# Altium schematic sheet SCH_Stepper-Spindle-Controller_2024-04-30.schdoc
size 287 x 171 mm
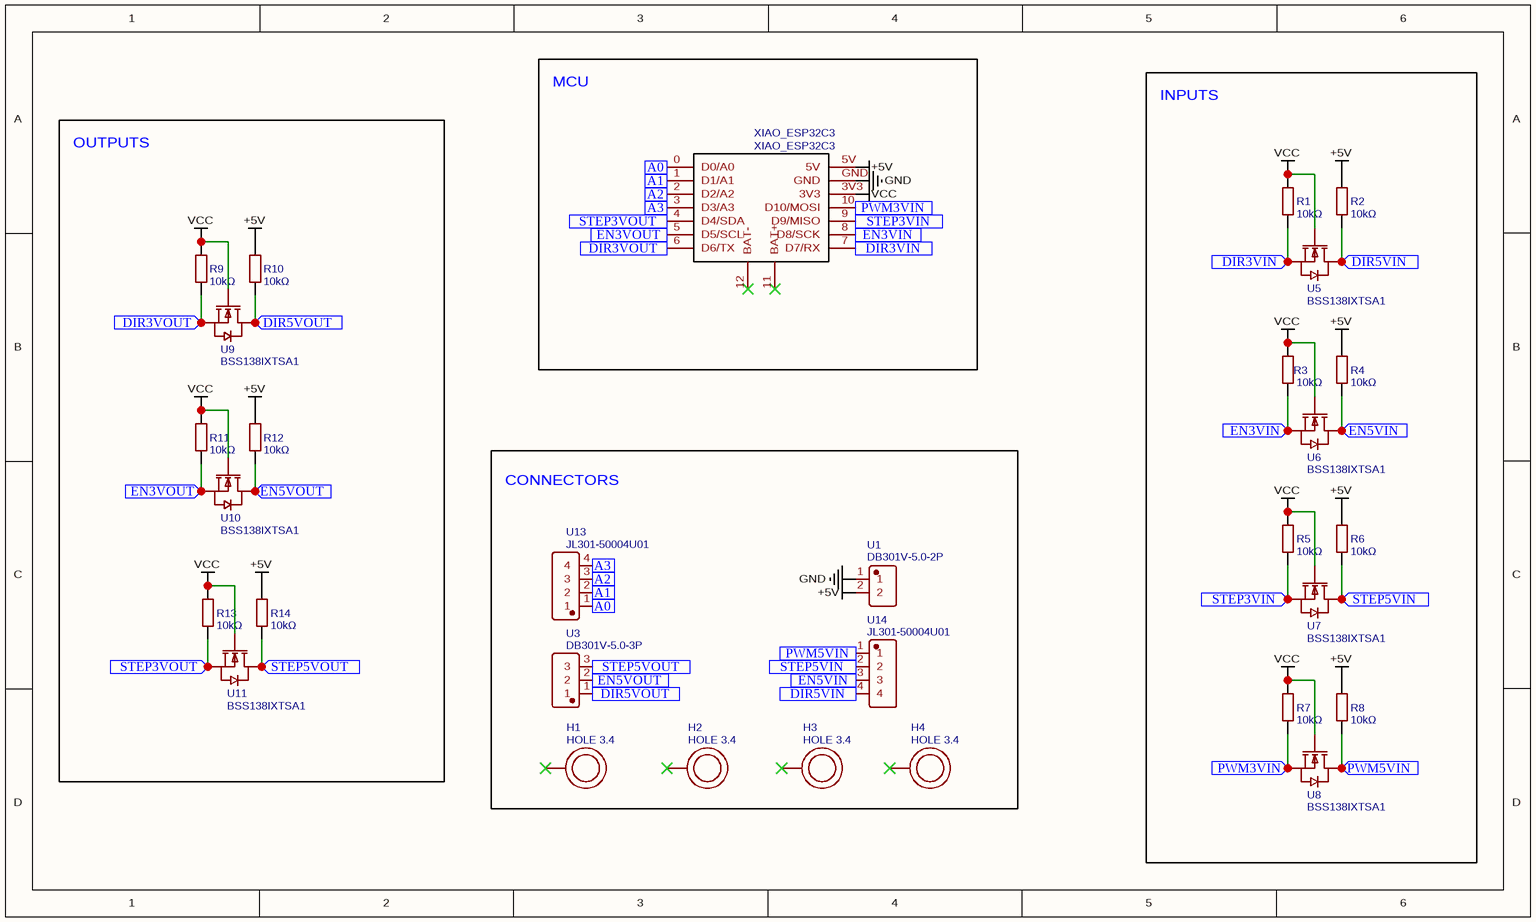
[diagram p0: SCH_Stepper-Spindle-Controller_2024-04-30.schdoc]

## Parts
H1  HOLE 3.4  [HOLEHOLE]
H2  HOLE 3.4  [HOLEHOLE]
H3  HOLE 3.4  [HOLEHOLE]
H4  HOLE 3.4  [HOLEHOLE]
R1  10kΩ  [R0402]
R2  10kΩ  [R0402]
R3  10kΩ  [R0402]
R4  10kΩ  [R0402]
R5  10kΩ  [R0402]
R6  10kΩ  [R0402]
R7  10kΩ  [R0402]
R8  10kΩ  [R0402]
R9  10kΩ  [R0402]
R10  10kΩ  [R0402]
R11  10kΩ  [R0402]
R12  10kΩ  [R0402]
R13  10kΩ  [R0402]
R14  10kΩ  [R0402]
U1  DB301V-5.0-2P  [CONN-TH_2P-P5.00_L7.6-W10.0]
U3  DB301V-5.0-3P  [CONN-TH_DB301V-5.0-3P]
U5  BSS138IXTSA1  [SOT-23-3_L2.9-W1.3-P1.90-LS2.4-BR]
U6  BSS138IXTSA1  [SOT-23-3_L2.9-W1.3-P1.90-LS2.4-BR]
U7  BSS138IXTSA1  [SOT-23-3_L2.9-W1.3-P1.90-LS2.4-BR]
U8  BSS138IXTSA1  [SOT-23-3_L2.9-W1.3-P1.90-LS2.4-BR]
U9  BSS138IXTSA1  [SOT-23-3_L2.9-W1.3-P1.90-LS2.4-BR]
U10  BSS138IXTSA1  [SOT-23-3_L2.9-W1.3-P1.90-LS2.4-BR]
U11  BSS138IXTSA1  [SOT-23-3_L2.9-W1.3-P1.90-LS2.4-BR]
U13  JL301-50004U01  [CONN-TH_JL301-50004U01]
U14  JL301-50004U01  [CONN-TH_JL301-50004U01]
XIAO_ESP32C3  XIAO_ESP32C3  [XIAO-ESP32-C3]

## Blocks framed on the sheet
MCU: XIAO_ESP32C3
INPUTS: R1-R8 U5-U8
OUTPUTS: R9-R14 U9-U11
CONNECTORS: H1-H4 U1 U3 U13 U14

## Ports
A0 (in), A1 (in), A2 (in), A3 (in), DIR3VIN (in), DIR3VOUT (in), DIR5VIN (in), DIR5VOUT (in), EN3VIN (in), EN3VOUT (in), EN5VIN (in), EN5VOUT (in), PWM3VIN (in), PWM5VIN (in), STEP3VIN (in), STEP3VOUT (in), STEP5VIN (in), STEP5VOUT (in)

## Nets
+5V: R2.2 R4.2 R6.2 R8.2 R10.2 R12.2 R14.2 U1.2 XIAO_ESP32C3.5V
GND: U1.1 XIAO_ESP32C3.GND
VCC: R1.2 R3.2 R5.2 R7.2 R9.2 R11.2 R13.2 U5.1(G) U6.1(G) U7.1(G) U8.1(G) U9.1(G) U10.1(G) U11.1(G) XIAO_ESP32C3.3V3
A0: U13.1 XIAO_ESP32C3.0(D0/A0) ; port A0
A1: U13.2 XIAO_ESP32C3.1(D1/A1) ; port A1
A2: U13.3 XIAO_ESP32C3.2(D2/A2) ; port A2
A3: U13.4 XIAO_ESP32C3.3(D3/A3) ; port A3
DIR3VIN: R1.1 U5.2(S) XIAO_ESP32C3.7(D7/RX) ; port DIR3VIN
DIR3VOUT: R9.1 U9.2(S) XIAO_ESP32C3.6(D6/TX) ; port DIR3VOUT
DIR5VIN: R2.1 U5.3(D) U14.4 ; port DIR5VIN
DIR5VOUT: R10.1 U3.1 U9.3(D) ; port DIR5VOUT
EN3VIN: R3.1 U6.2(S) XIAO_ESP32C3.8(D8/SCK) ; port EN3VIN
EN3VOUT: R11.1 U10.2(S) XIAO_ESP32C3.5(D5/SCL) ; port EN3VOUT
EN5VIN: R4.1 U6.3(D) U14.3 ; port EN5VIN
EN5VOUT: R12.1 U3.2 U10.3(D) ; port EN5VOUT
PWM3VIN: R7.1 U8.2(S) XIAO_ESP32C3.10(D10/MOSI) ; port PWM3VIN
PWM5VIN: R8.1 U8.3(D) U14.1 ; port PWM5VIN
STEP3VIN: R5.1 U7.2(S) XIAO_ESP32C3.9(D9/MISO) ; port STEP3VIN
STEP3VOUT: R13.1 U11.2(S) XIAO_ESP32C3.4(D4/SDA) ; port STEP3VOUT
STEP5VIN: R6.1 U7.3(D) U14.2 ; port STEP5VIN
STEP5VOUT: R14.1 U3.3 U11.3(D) ; port STEP5VOUT

Not connected (* = marked no-connect by the designer): H1 1*; H2 1*; H3 1*; H4 1*; XIAO_ESP32C3 11(BAT+)* 12(BAT-)*

## Library data of the parts
H1-H4 = HOLE 3.4: Contributor: Cillié Malan; spicePre: H; spiceSymbolName: HOLE 3.4
R1-R14 = 10kΩ: Manufacturer: PANASONIC(松下); Manufacturer Part: ERA2AEB103X; nameAlias: Value; Contributor: LCSC; Supplier: LCSC; Supplier Part: C191915; JLCPCB Part Class: Extended Part; spicePre: R; spiceSymbolName: ERA2AEB103X
U1 = DB301V-5.0-2P: Manufacturer: DORABO(地博电气); Manufacturer Part: DB301V-5.0-2P-BU-S; Contributor: LCSC; Supplier: LCSC; Supplier Part: C395882; JLCPCB Part Class: Extended Part; spicePre: U; spiceSymbolName: DB301V-5.0-2P
U3 = DB301V-5.0-3P: Manufacturer: DORABO(地博电气); Manufacturer Part: DB301V-5.0-3P-BU-S; Contributor: LCSC; Supplier: LCSC; Supplier Part: C395881; JLCPCB Part Class: Extended Part; spicePre: U; spiceSymbolName: DB301V-5.0-3P
U5-U11 = BSS138IXTSA1: Manufacturer: Infineon(英飞凌); Contributor: lcsc; Supplier: LCSC; Supplier Part: C3278610; Manufacturer Part: BSS138IXTSA1; spicePre: U; spiceSymbolName: BSS138IXTSA1
U13 U14 = JL301-50004U01: Manufacturer: JILN(锦凌); Contributor: LCSC; Supplier: LCSC; Supplier Part: C1509680; Manufacturer Part: JL301-50004U01; JLCPCB Part Class: Extended Part; spicePre: U; spiceSymbolName: JL301-50004U01
XIAO_ESP32C3 = XIAO_ESP32C3: Manufacturer: SeeedStudio; Manufacturer Part: XIAO ESP32C3; Contributor: hydrafi; Supplier Part: 1597-113991054-ND; Supplier: Digi-Key; link: https://wiki.seeedstudio.com/XIAO_ESP32C3_Getting_Started/; spicePre: U; spiceSymbolName: XIAO_ESP32C3